# EAGLE design schema_v3_0 (EAGLE 6.4)
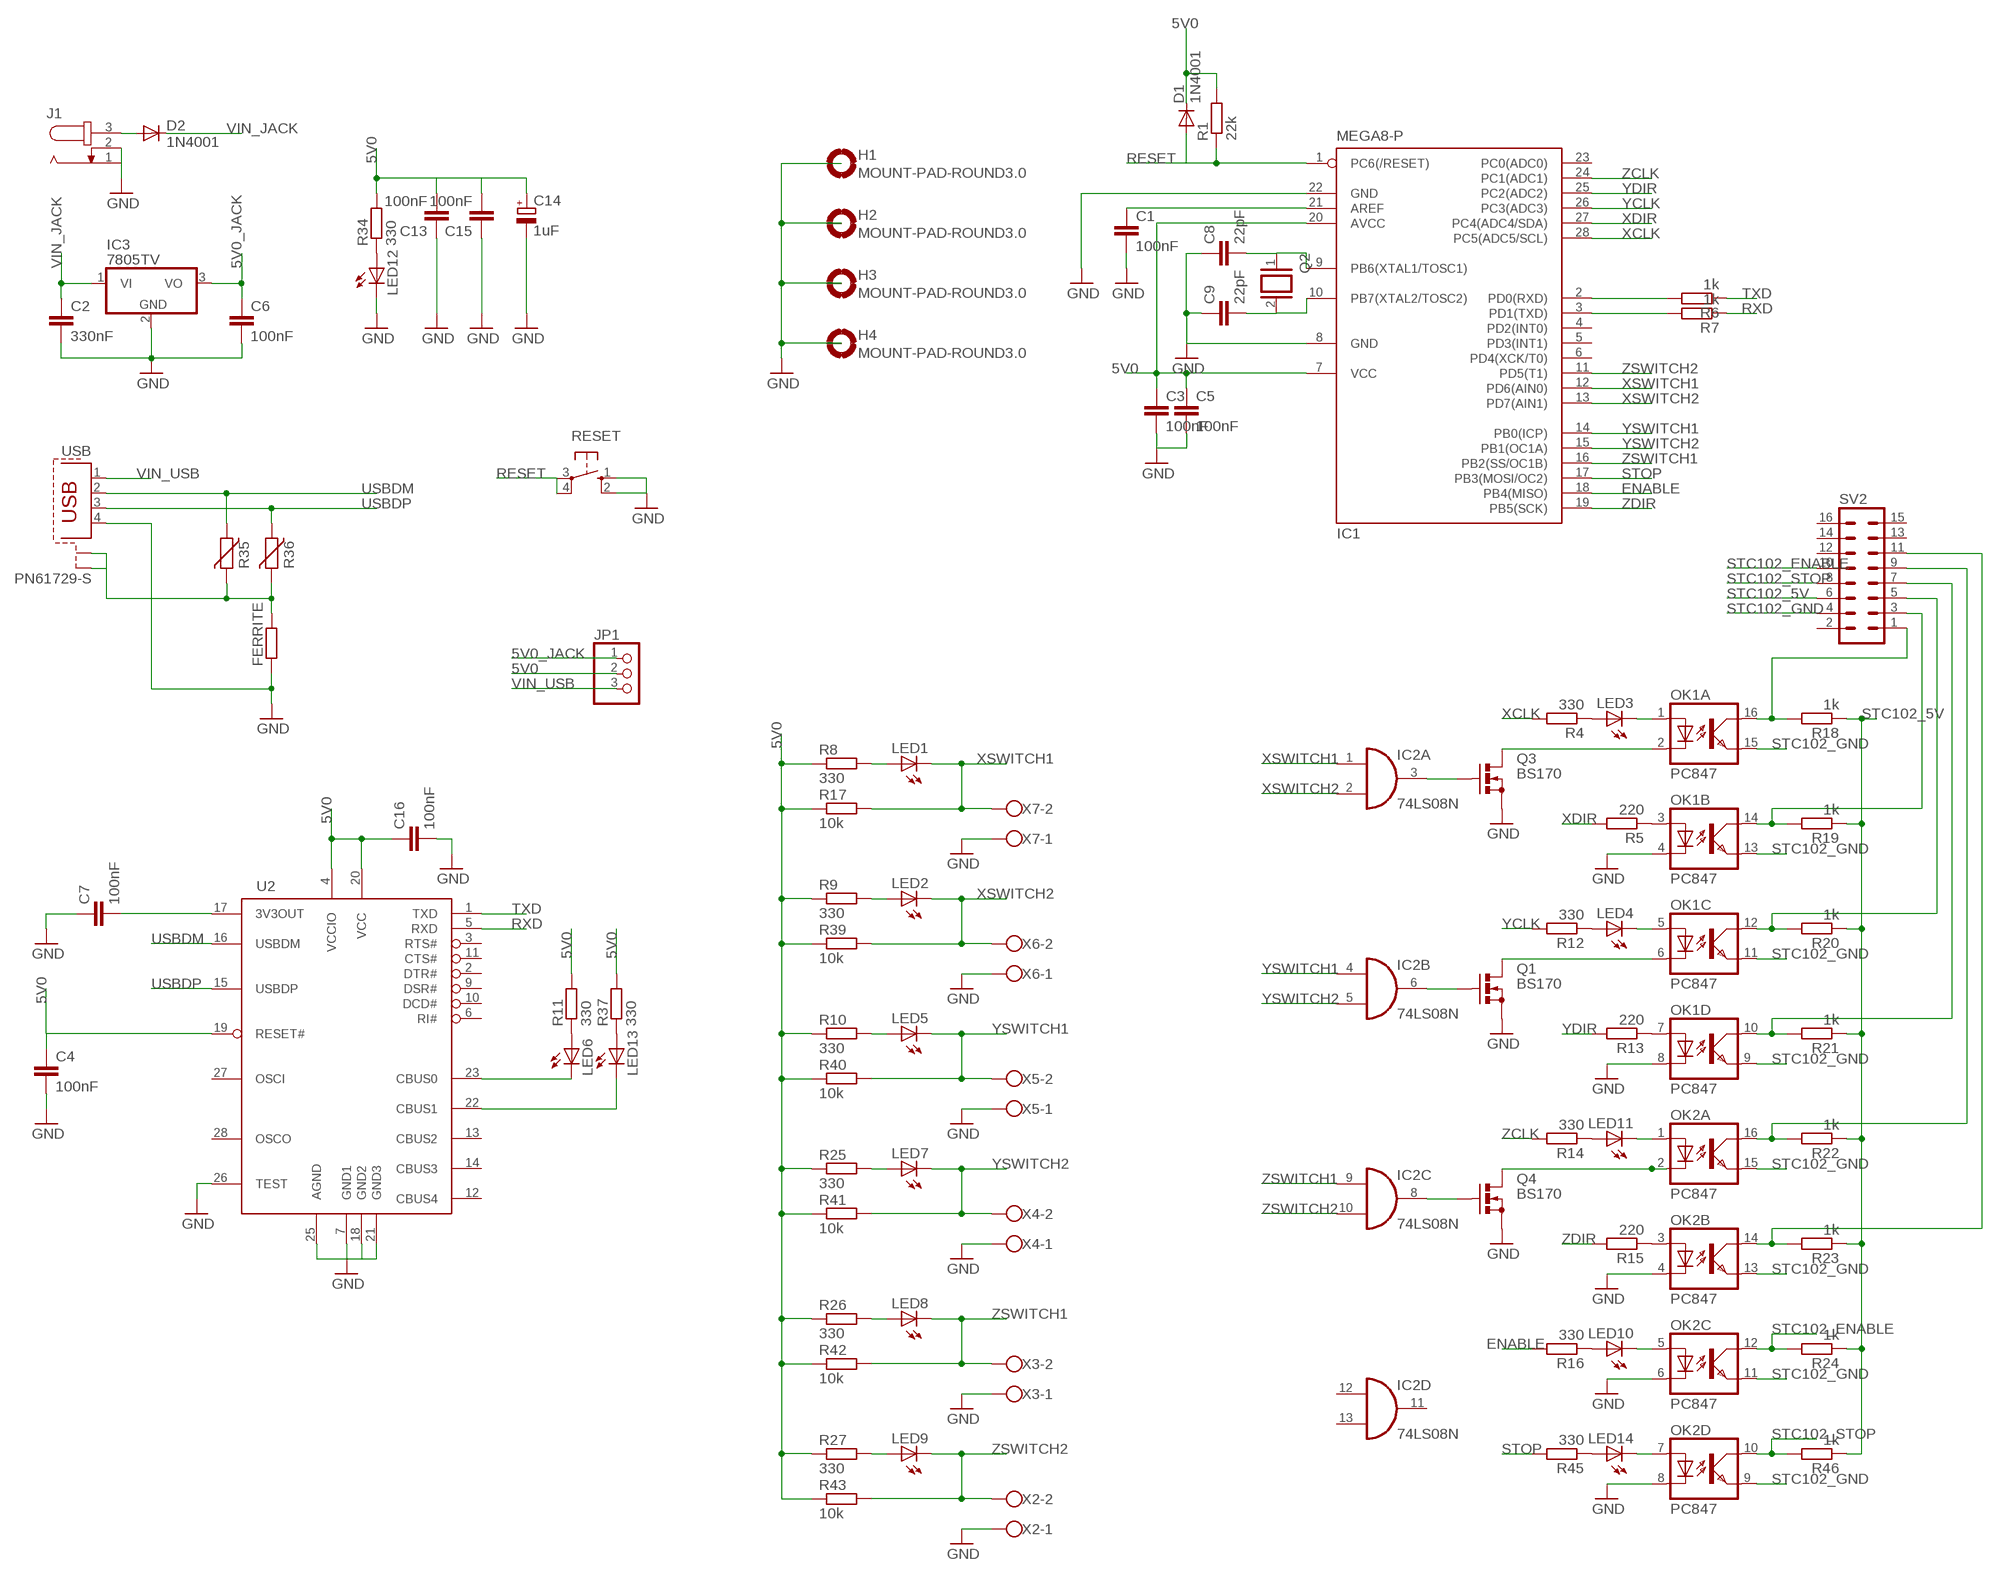
[diagram p0: schematic, sheet 1]

## Parts
C1  100nF  C-EUC0805  [C0805]
C2  330nF  C-EU025-025X050  [C025-025X050]
C3  100nF  C-EU025-025X050  [C025-025X050]
C4  100nF  C-EUC0603K  [C0603K]
C5  100nF  C-EU025-025X050  [C025-025X050]
C6  100nF  C-EU025-025X050  [C025-025X050]
C7  100nF  C-EUC0603K  [C0603K]
C8  22pF  C-EU025-025X050  [C025-025X050]
C9  22pF  C-EU025-025X050  [C025-025X050]
C13  100nF  C-EU025-025X050  [C025-025X050]
C14  1uF  CPOL-EUE2.5-5  [E2,5-5]
C15  100nF  C-EU025-025X050  [C025-025X050]
C16  100nF  C-EUC0603K  [C0603K]
D1  1N4001  1N4004  [DO41-10]
D2  1N4001  1N4004  [DO41-10]
FERRITE  R-EU_M0805  [M0805]
H1  MOUNT-PAD-ROUND3.0  [3,0-PAD]
H2  MOUNT-PAD-ROUND3.0  [3,0-PAD]
H3  MOUNT-PAD-ROUND3.0  [3,0-PAD]
H4  MOUNT-PAD-ROUND3.0  [3,0-PAD]
IC1  MEGA8-P  [DIL28-3]
IC2  74LS08N  [DIL14]
IC3  7805TV  [TO220V]
J1  JACK-PLUG0  [SPC4077]
JP1  PINHD-1X3  [1X03]
LED1  LED3MM  [LED3MM]
LED2  LED3MM  [LED3MM]
LED3  LED3MM  [LED3MM]
LED4  LED3MM  [LED3MM]
LED5  LED3MM  [LED3MM]
LED6  LED3MM  [LED3MM]
LED7  LED3MM  [LED3MM]
LED8  LED3MM  [LED3MM]
LED9  LED3MM  [LED3MM]
LED10  LED3MM  [LED3MM]
LED11  LED3MM  [LED3MM]
LED12  LED3MM  [LED3MM]
LED13  LED3MM  [LED3MM]
LED14  LED3MM  [LED3MM]
OK1  PC847  [DIL16]
OK2  PC847  [DIL16]
Q1  BS170  [SOT54E]
Q2  XTAL/S  [QS]
Q3  BS170  [SOT54E]
Q4  BS170  [SOT54E]
R1  22k  R-EU_0207/10  [0207/10]
R4  330  R-EU_0207/10  [0207/10]
R5  220  R-EU_0207/10  [0207/10]
R6  1k  R-EU_0207/10  [0207/10]
R7  1k  R-EU_0207/10  [0207/10]
R8  330  R-EU_0207/10  [0207/10]
R9  330  R-EU_0207/10  [0207/10]
R10  330  R-EU_0207/10  [0207/10]
R11  330  R-EU_0207/10  [0207/10]
R12  330  R-EU_0207/10  [0207/10]
R13  220  R-EU_0207/10  [0207/10]
R14  330  R-EU_0207/10  [0207/10]
R15  220  R-EU_0207/10  [0207/10]
R16  330  R-EU_0207/10  [0207/10]
R17  10k  R-EU_0207/10  [0207/10]
R18  1k  R-EU_0207/10  [0207/10]
R19  1k  R-EU_0207/10  [0207/10]
R20  1k  R-EU_0207/10  [0207/10]
R21  1k  R-EU_0207/10  [0207/10]
R22  1k  R-EU_0207/10  [0207/10]
R23  1k  R-EU_0207/10  [0207/10]
R24  1k  R-EU_0207/10  [0207/10]
R25  330  R-EU_0207/10  [0207/10]
R26  330  R-EU_0207/10  [0207/10]
R27  330  R-EU_0207/10  [0207/10]
R34  330  R-EU_0207/10  [0207/10]
R35  VARISTORCN0603  [CT/CN0603]
R36  VARISTORCN0603  [CT/CN0603]
R37  330  R-EU_0207/10  [0207/10]
R39  10k  R-EU_0207/10  [0207/10]
R40  10k  R-EU_0207/10  [0207/10]
R41  10k  R-EU_0207/10  [0207/10]
R42  10k  R-EU_0207/10  [0207/10]
R43  10k  R-EU_0207/10  [0207/10]
R45  330  R-EU_0207/10  [0207/10]
R46  1k  R-EU_0207/10  [0207/10]
RESET  10-XX  [B3F-10XX]
SV2  MA08-2  [MA08-2]
U2  FT232RL  [SSOP28DB]
USB  PN61729-S  [PN61729-S]
X2  W237-102  [W237-102]
X3  W237-102  [W237-102]
X4  W237-102  [W237-102]
X5  W237-102  [W237-102]
X6  W237-102  [W237-102]
X7  W237-102  [W237-102]

## Nets
5V0: C3.1 C4.1 C5.1 C13.2 C14.+ C15.2 C16.1 D1.C IC1.7(VCC) IC1.20(AVCC) JP1.2 R1.2 R8.1 R9.1 R10.1 R11.2 R17.1 R25.1 R26.1 R27.1 R34.2 R37.2 R39.1 R40.1 R41.1 R42.1 R43.1 U2.4(VCCIO) U2.19(RESET#) U2.20(VCC)
5V0_JACK: C6.1 IC3.3(VO) JP1.1
ENABLE: IC1.18(PB4(MISO)) R16.2
GND: C1.2 C2.2 C3.2 C4.2 C5.2 C6.2 C7.1 C8.1 C9.1 C13.1 C14.- C15.1 C16.2 FERRITE.1 IC1.8(GND) IC1.22(GND) IC3.2(GND) J1.1 J1.2 LED12.K(C) OK1.4(B:C) OK1.8(D:C) OK2.4(B:C) OK2.6(C:C) OK2.8(D:C) Q1.S Q3.S Q4.S RESET.1(S) RESET.2(S1) U2.7(GND1) U2.18(GND2) U2.21(GND3) U2.25(AGND) U2.26(TEST) USB.4 X2.1 X3.1 X4.1 X5.1 X6.1 X7.1
N$1: LED3.A R4.1
N$2: LED1.A R8.2
N$3: C1.1 IC1.21(AREF)
N$4: LED10.A R16.1
N$5: OK1.2(A:C) Q3.D
N$6: LED4.A R12.1
N$7: LED11.A R14.1
N$8: D2.A J1.3
N$9: OK1.16(A:COL) R18.2 SV2.1
N$10: LED14.A R45.1
N$11: OK1.14(B:COL) R19.2 SV2.3
N$12: OK1.12(C:COL) R20.2 SV2.5
N$13: OK1.10(D:COL) R21.2 SV2.7
N$14: OK2.16(A:COL) R22.2 SV2.9
N$15: OK2.14(B:COL) R23.2 SV2.11
N$16: LED2.A R9.2
N$17: LED6.K(C) U2.23(CBUS0)
N$18: LED13.K(C) U2.22(CBUS1)
N$19: LED6.A R11.1
N$20: LED14.K(C) OK2.7(D:A)
N$21: IC2.3(A:O) Q3.G
N$22: LED10.K(C) OK2.5(C:A)
N$23: LED5.A R10.2
N$24: LED7.A R25.2
N$25: IC1.2(PD0(RXD)) R6.2
N$26: IC1.3(PD1(TXD)) R7.2
N$27: LED8.A R26.2
N$28: LED9.A R27.2
N$29: C8.2 IC1.9(PB6(XTAL1/TOSC1)) Q2.1
N$30: OK1.3(B:A) R5.1
N$31: LED4.K(C) OK1.5(C:A)
N$32: OK1.7(D:A) R13.1
N$33: LED3.K(C) OK1.1(A:A)
N$34: OK2.3(B:A) R15.1
N$35: C9.2 IC1.10(PB7(XTAL2/TOSC2)) Q2.2
N$36: OK1.6(C:C) Q1.D
N$37: OK2.2(A:C) Q4.D
N$38: IC2.8(C:O) Q4.G
N$39: IC2.6(B:O) Q1.G
N$40: LED11.K(C) OK2.1(A:A)
N$51: LED12.A R34.1
N$53: FERRITE.2 R35.2 R36.2 USB.S1 USB.S2
N$55: LED13.A R37.1
N$96: C7.2 U2.17(3V3OUT)
RESET: D1.A IC1.1(PC6(/RESET)) R1.1 RESET.3(P) RESET.4(P1)
RXD: R7.1 U2.5(RXD)
STC102_5V: R18.1 R19.1 R20.1 R21.1 R22.1 R23.1 R24.1 R46.1 SV2.6
STC102_ENABLE: OK2.12(C:COL) R24.2 SV2.10
STC102_GND: OK1.9(D:EMIT) OK1.11(C:EMIT) OK1.13(B:EMIT) OK1.15(A:EMIT) OK2.9(D:EMIT) OK2.11(C:EMIT) OK2.13(B:EMIT) OK2.15(A:EMIT) SV2.4
STC102_STOP: OK2.10(D:COL) R46.2 SV2.8
STOP: IC1.17(PB3(MOSI/OC2)) R45.2
TXD: R6.1 U2.1(TXD)
USBDM: R35.1 U2.16(USBDM) USB.2
USBDP: R36.1 U2.15(USBDP) USB.3
VIN_JACK: C2.1 D2.C IC3.1(VI)
VIN_USB: JP1.3 USB.1
XCLK: IC1.28(PC5(ADC5/SCL)) R4.2
XDIR: IC1.27(PC4(ADC4/SDA)) R5.2
XSWITCH1: IC1.12(PD6(AIN0)) IC2.1(A:I0) LED1.K(C) R17.2 X7.2
XSWITCH2: IC1.13(PD7(AIN1)) IC2.2(A:I1) LED2.K(C) R39.2 X6.2
YCLK: IC1.26(PC3(ADC3)) R12.2
YDIR: IC1.25(PC2(ADC2)) R13.2
YSWITCH1: IC1.14(PB0(ICP)) IC2.4(B:I0) LED5.K(C) R40.2 X5.2
YSWITCH2: IC1.15(PB1(OC1A)) IC2.5(B:I1) LED7.K(C) R41.2 X4.2
ZCLK: IC1.24(PC1(ADC1)) R14.2
ZDIR: IC1.19(PB5(SCK)) R15.2
ZSWITCH1: IC1.16(PB2(SS/OC1B)) IC2.9(C:I0) LED8.K(C) R42.2 X3.2
ZSWITCH2: IC1.11(PD5(T1)) IC2.10(C:I1) LED9.K(C) R43.2 X2.2
Unconnected: H1.B3,0(MOUNT) H2.B3,0(MOUNT) H3.B3,0(MOUNT) H4.B3,0(MOUNT) IC1.4(PD2(INT0)) IC1.5(PD3(INT1)) IC1.6(PD4(XCK/T0)) IC1.23(PC0(ADC0)) IC2.11(D:O) IC2.12(D:I0) IC2.13(D:I1) SV2.2 SV2.12 SV2.13 SV2.14 SV2.15 SV2.16 U2.2(DTR#) U2.3(RTS#) U2.6(RI#) U2.9(DSR#) U2.10(DCD#) U2.11(CTS#) U2.12(CBUS4) U2.13(CBUS2) U2.14(CBUS3) U2.27(OSCI) U2.28(OSCO)

## Power pins joined to a net without a drawn wire
GND: IC2.7(P:GND)
VCC: IC2.14(P:VCC)

## Library data of the parts
C1-C9 C13 C15 C16 = rcl:C-EU: CAPACITOR, European symbol
C14 = rcl:CPOL-EU: POLARIZED CAPACITOR, European symbol
D1 D2 = diode:1N4004: DIODE general purpose rectifier, 1 A
FERRITE = resistor:R-EU_: RESISTOR, European symbol
H1-H4 = holes:MOUNT-PAD-ROUND: MOUNTING PAD, round
IC1 = atmel:MEGA8-P: MICROCONTROLLER 8 Kbytes FLASH, 1 kbytes SRAM, 512 bytes EEPROM, USART, 4-channel 10 bit ADC, 2-channel 8 bit ADC Pin compatible with Atmega48, ATMega88, ATMega168 Source: avr.lbr; OC_FARNELL: unknown; OC_NEWARK: unknown
IC2 = 74xx-eu:74*08: Quad 2-input AND gate
IC3 = linear:78*: Positive VOLTAGE REGULATOR Source: http://cache.national.com/ds/LM/LM78L05.pdf http://www.fairchildsemi.com/ds/LM/LM7805.pdf
J1 = con-jack:JACK-PLUG: DC POWER JACK Power Jack, DC, Right Angle, Through Hole, Rated 5A at 16VDC, PC Terminals Distributor: Farnell (www.Farnell.de) Drawing: 84N1161.pdf / 84N1162.pdf Manufacturer: SPC Technology (www.spctechnology.com) Type: SPC4077 / SPC 4078; OC_FARNELL: unknown; OC_NEWARK: unknown
JP1 = pinhead:PINHD-1X3: PIN HEADER
LED1-LED14 = led:LED: LED OSRAM: - CHIPLED LG R971, LG N971, LY N971, LG Q971, LY Q971, LO R971, LY R971 LH N974, LH R974 LS Q976, LO Q976, LY Q976 LO Q996 - Hyper CHIPLED LW Q18S LB Q993, LB Q99A, LB R99A - SideLED LS A670, LO A670, LY A670, LG A670, LP A670 LB A673, LV A673, LT A673, LW A673 LH A674 LY A675 LS A676, LA A676, LO A676, LY A676, LW A676 LS A679, LY A679, LG A679 - Hyper Micro SIDELED® LS Y876, LA Y876, LO Y876, LY Y876 LT Y87S - SmartLED LW L88C, LW L88S LB L89C, LB L89S, LG L890 LS L89K, LO L89K, LY L89K LS L896, LA L896, LO L896, LY L896 - TOPLED LS T670, LO T670, LY T670, LG T670, LP T670 LSG T670, LSP T670, LSY T670, LOP T670, LYG T670 LG T671, LOG T671, LSG T671 LB T673, LV T673, LT T673, LW T673 LH T674 LS T676, LA T676, LO T676, LY T676, LB T676, LH T676, LSB T676, LW T676 LB T67C, LV T67C, LT T67C, LS T67K, LO T67K, LY T67K, LW E67C LS E67B, LA E67B, LO E67B, LY E67B, LB E67C, LV E67C, LT E67C LW T67C LS T679, LY T679, LG T679 LS T770, LO T770, LY T770, LG T770, LP T770 LB T773, LV T773, LT T773, LW T773 LH T774 LS E675, LA E675, LY E675, LS T675 LS T776, LA T776, LO T776, LY T776, LB T776 LHGB T686 LT T68C, LB T68C - Hyper Mini TOPLED® LB M676 - Mini TOPLED Santana® LG M470 LS M47K, LO M47K, LY M47K Source: http://www.osram.convergy.de LUXEON: - LUMILED® LXK2-PW12-R00, LXK2-PW12-S00, LXK2-PW14-U00, LXK2-PW14-V00 LXK2-PM12-R00, LXK2-PM12-S00, LXK2-PM14-U00 LXK2-PE12-Q00, LXK2-PE12-R00, LXK2-PE12-S00, LXK2-PE14-T00, LXK2-PE14-U00 LXK2-PB12-K00, LXK2-PB12-L00, LXK2-PB12-M00, LXK2-PB14-N00, LXK2-PB14-P00, LXK2-PB14-Q00 LXK2-PR12-L00, LXK2-PR12-M00, LXK2-PR14-Q00, LXK2-PR14-R00 LXK2-PD12-Q00, LXK2-PD12-R00, LXK2-PD12-S00 LXK2-PH12-R00, LXK2-PH12-S00 LXK2-PL12-P00, LXK2-PL12-Q00, LXK2-PL12-R00 Source: www.luxeon.com KINGBRIGHT: KA-3528ASYC Source: www.kingbright.com
OK1 OK2 = optocoupler:PC847: SHARP OPTO COUPLER; OC_FARNELL: 9707735; OC_NEWARK: unknown
Q1 Q3 Q4 = transistor-small-signal:BS170: N-CHANNEL MOS FET
Q2 = special:XTAL/S: CRYSTAL
R1 R4-R27 R34 R37 R39-R43 R45 R46 = rcl:R-EU_: RESISTOR, European symbol
R35 R36 = varistor:VARISTOR: VARISTOR
RESET = switch-omron:10-XX: OMRON SWITCH; MPN: B3F-1000; OC_FARNELL: 176432; OC_NEWARK: 36M3542
SV2 = con-lstb:MA08-2: PIN HEADER; OC_FARNELL: unknown; OC_NEWARK: unknown
U2 = ftdichip-5:FT232RL: USB UART 4th Generation USB UART (USB <-> Serial) Controller
USB = con-berg:PN61729-S: BERG USB connector; OC_FARNELL: unknown; OC_NEWARK: unknown
X2-X7 = con-wago-500:W237-102: WAGO SCREW CLAMP; MPN: 237-102; OC_FARNELL: unknown; OC_NEWARK: 70K9898

## Net classes
0 default: width 0.203 mm

## Board
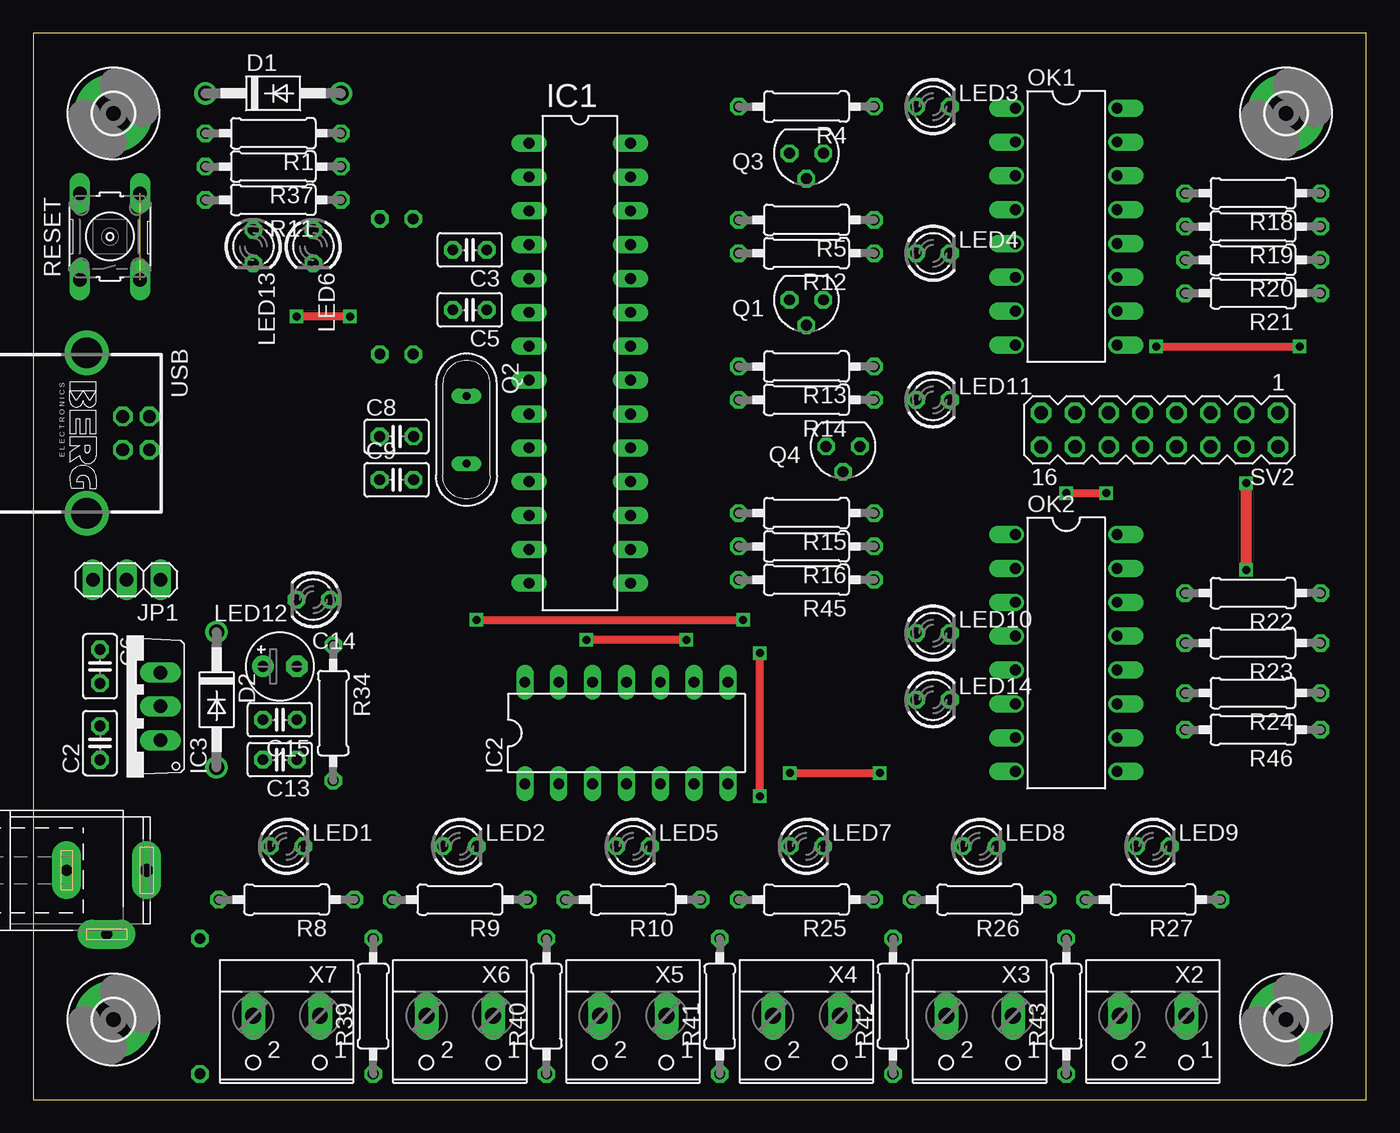
[diagram p1: board, top side]
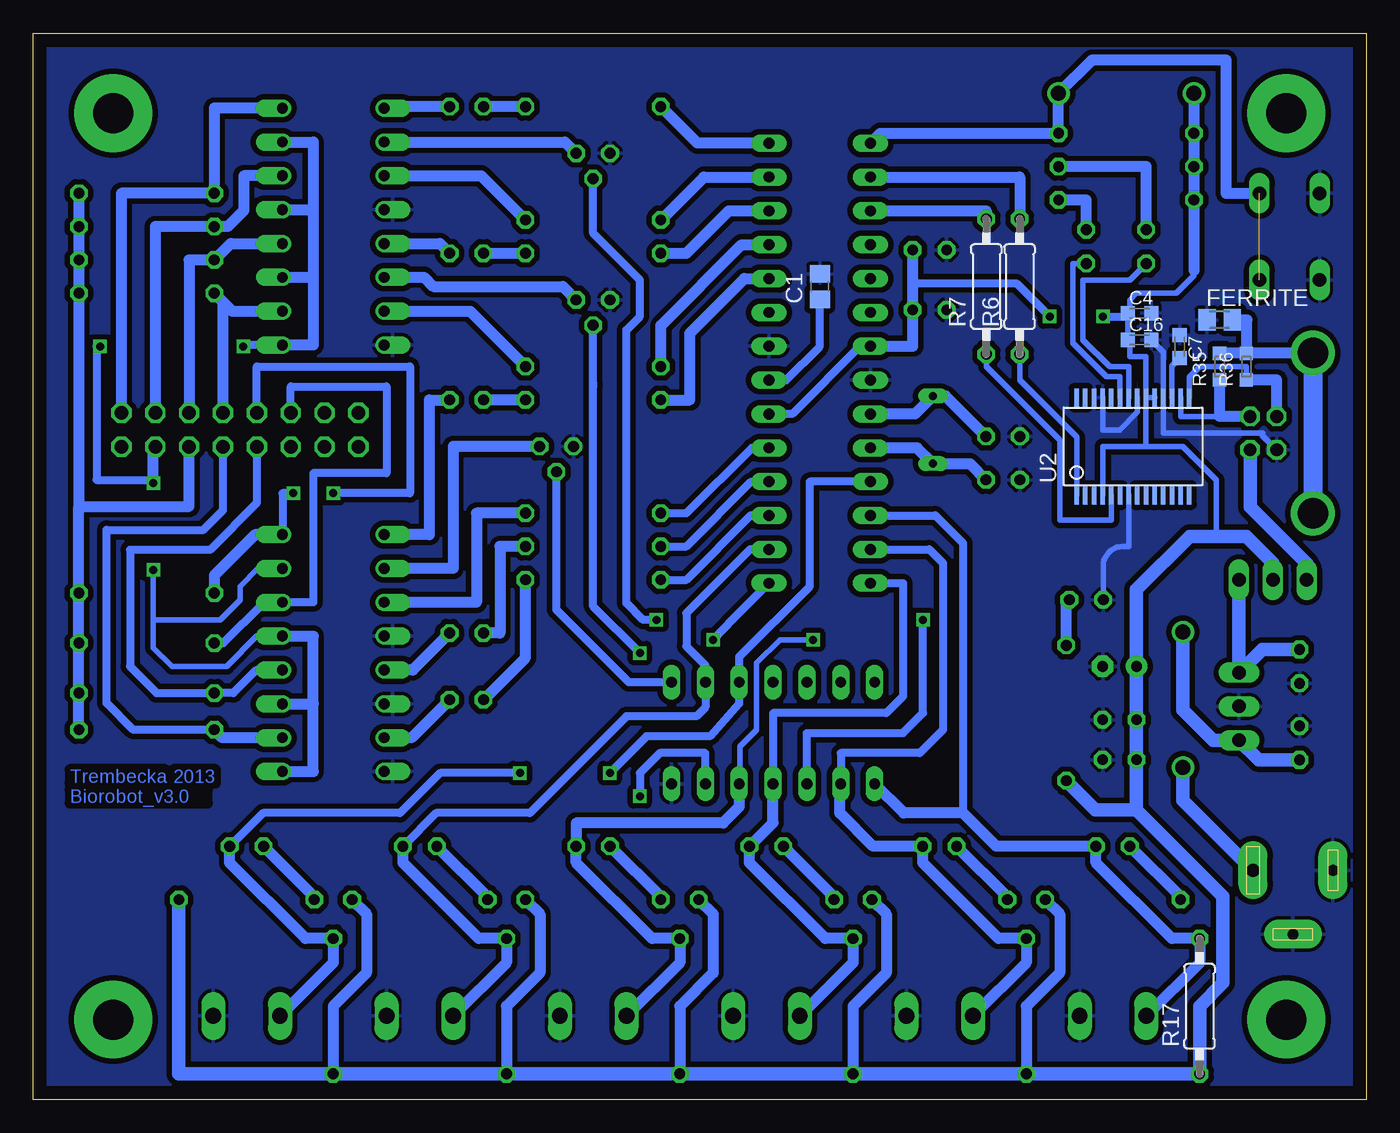
[diagram p2: board, bottom side, seen from below]

Size 100 x 80 mm. Coordinates in mm from the lower left corner, seen from the top.
Outline: 0,0 100,0 100,80 0,80 0,0
Copper layers (1*16): Top 0.035mm / dielectric 1.5mm / Bottom 0.035mm
Design rules "default": minimum track width 10mil, minimum drill 24mil, track to track 8mil, track to pad 8mil, pad to pad 8mil, via to via 8mil, smd to smd 8mil, copper to edge 40mil, drill to drill 8mil, minimum pad ring 10mil, minimum via ring 8mil, stop-mask expansion 4mil, vias tented up to drill 0mil, thermal gap 10mil

### Footprints (pad centres in the part's own frame; a part is rotated, then mirrored left to right if it is on the bottom)
C0805 = smd 1.3 x 1.5: 1 -0.95,0; 2 0.95,0
C025-025X050 = drill 0.813 octagon: 1 -1.27,0; 2 1.27,0
C0603K = smd 1.05 x 1.08: 1 -0.875,0; 2 0.875,0
E2,5-5 = drill 0.813 pad 1.6: + -1.27,0 | drill 0.813 pad 1.6 octagon: - 1.27,0
DO41-10 = drill 1.118: A 5.08,0; C -5.08,0
M0805 = smd 1.3 x 1.6: 1 -0.95,0; 2 0.95,0
3,0-PAD = drill 3 pad 5.842: B3,0 0,0
DIL28-3 = drill 0.813 long: 1 -16.51,-3.81; 2 -13.97,-3.81; 3 -11.43,-3.81; 4 -8.89,-3.81; 5 -6.35,-3.81; 6 -3.81,-3.81; 7 -1.27,-3.81; 8 1.27,-3.81; 9 3.81,-3.81; 10 6.35,-3.81; 11 8.89,-3.81; 12 11.43,-3.81; 13 13.97,-3.81; 14 16.51,-3.81; 15 16.51,3.81; 16 13.97,3.81; 17 11.43,3.81; 18 8.89,3.81; 19 6.35,3.81; 20 3.81,3.81; 21 1.27,3.81; 22 -1.27,3.81; 23 -3.81,3.81; 24 -6.35,3.81; 25 -8.89,3.81; 26 -11.43,3.81; 27 -13.97,3.81; 28 -16.51,3.81
DIL14 = drill 0.813 long: 1 -7.62,-3.81; 2 -5.08,-3.81; 3 -2.54,-3.81; 4 0,-3.81; 5 2.54,-3.81; 6 5.08,-3.81; 7 7.62,-3.81; 8 7.62,3.81; 9 5.08,3.81; 10 2.54,3.81; 11 0,3.81; 12 -2.54,3.81; 13 -5.08,3.81; 14 -7.62,3.81
TO220V = drill 1.016 long: 1 -2.54,-2.54; 2 0,-2.54; 3 2.54,-2.54
SPC4077 = drill 0.8 pad 2.184 long: 1 -3,0; 2 0,-4.8 | drill 1 pad 2.184 long: 3 3,0
1X03 = drill 1.016 long: 1 -2.54,0; 2 0,0; 3 2.54,0
LED3MM = drill 0.813 octagon: A -1.27,0; K 1.27,0
DIL16 = drill 0.813 offset: 1 -8.89,-3.81; 2 -6.35,-3.81; 3 -3.81,-3.81; 4 -1.27,-3.81; 5 1.27,-3.81; 6 3.81,-3.81; 7 6.35,-3.81; 8 8.89,-3.81; 9 8.89,3.81; 10 6.35,3.81; 11 3.81,3.81; 12 1.27,3.81; 13 -1.27,3.81; 14 -3.81,3.81; 15 -6.35,3.81; 16 -8.89,3.81
SOT54E = drill 0.813 octagon: D -1.27,0; G 0,1.905; S 1.27,0
QS = drill 0.61 long: 1 -2.54,0; 2 2.54,0
0207/10 = drill 0.813 octagon: 1 -5.08,0; 2 5.08,0
CT/CN0603 = smd 1 x 1: 1 -1,0; 2 1,0
B3F-10XX = drill 1.016 long: 1 -3.251,2.261; 2 3.251,2.261; 3 -3.251,-2.261; 4 3.251,-2.261
MA08-2 = drill 1.016 octagon: 1 -8.89,-1.27; 2 -8.89,1.27; 3 -6.35,-1.27; 4 -6.35,1.27; 5 -3.81,-1.27; 6 -3.81,1.27; 7 -1.27,-1.27; 8 -1.27,1.27; 9 1.27,-1.27; 10 1.27,1.27; 11 3.81,-1.27; 12 3.81,1.27; 13 6.35,-1.27; 14 6.35,1.27; 15 8.89,-1.27; 16 8.89,1.27
SSOP28DB = smd 0.348 x 1.397: 1 -4.225,-3.656; 2 -3.575,-3.656; 3 -2.925,-3.656; 4 -2.275,-3.656; 5 -1.625,-3.656; 6 -0.975,-3.656; 7 -0.325,-3.656; 8 0.325,-3.656; 9 0.975,-3.656; 10 1.625,-3.656; 11 2.275,-3.656; 12 2.925,-3.656; 13 3.575,-3.656; 14 4.225,-3.656; 15 4.225,3.656; 16 3.575,3.656; 17 2.925,3.656; 18 2.275,3.656; 19 1.625,3.656; 20 0.975,3.656; 21 0.325,3.656; 22 -0.325,3.656; 23 -0.975,3.656; 24 -1.625,3.656; 25 -2.275,3.656; 26 -2.925,3.656; 27 -3.575,3.656; 28 -4.225,3.656
PN61729-S = drill 0.95 octagon: 1 1.25,4.71; 2 -1.25,4.71; 3 -1.25,2.71; 4 1.25,2.71 | drill 2.3 pad 2.9: S1 -6.02,0; S2 6.02,0
W237-102 = drill 1.194 long: 1 -2.5,-1.27; 2 2.5,-1.27

### Placement (x,y rotation side)
C1  41,61 90 bottom
C2  5,26.75 90 top
C3  32.75,63.75 180 top
C4  17,59 0 bottom
C5  32.75,59.25 180 top
C6  5,32.5 270 top
C7  14,56.5 270 bottom
C8  27.25,49.75 0 top
C9  27.25,46.5 0 top
C13  18.5,25.5 180 top
C14  18.5,32.5 0 top
C15  18.5,28.5 180 top
C16  17,57 0 bottom
D1  18,75.5 0 top
D2  13.75,30 270 top
FERRITE  11,58.5 0 bottom
H1  94,74 0 top
H2  6,74 0 top
H3  6,6 0 top
H4  94,6 0 top
IC1  41,55.25 270 top
IC2  44.5,27.5 0 top
IC3  7,29.5 90 top
J1  5.5,17.2 0 top
JP1  7,39 180 top
LED1  19,19 0 top
LED2  32,19 0 top
LED3  67.5,74.5 0 top
LED4  67.5,63.5 0 top
LED5  45,19 0 top
LED6  21,64 270 top
LED7  58,19 0 top
LED8  71,19 0 top
LED9  84,19 0 top
LED10  67.5,35 0 top
LED11  67.5,52.5 0 top
LED12  21,37.5 180 top
LED13  16.5,64 270 top
LED14  67.5,30 0 top
OK1  77.5,65.5 270 top
OK2  77.5,33.5 270 top
Q1  58,60 180 top
Q2  32.5,50.25 270 top
Q3  58,71 180 top
Q4  60.75,49 180 top
R1  18,72.5 180 top
R4  58,74.5 180 top
R5  58,66 180 top
R6  26,61 90 bottom
R7  28.5,61 90 bottom
R8  19,15 180 top
R9  32,15 180 top
R10  45,15 180 top
R11  18,67.5 180 top
R12  58,63.5 180 top
R13  58,55 180 top
R14  58,52.5 180 top
R15  58,44 180 top
R16  58,41.5 180 top
R17  12.5,7 90 bottom
R18  91.5,68 180 top
R19  91.5,65.5 180 top
R20  91.5,63 180 top
R21  91.5,60.5 180 top
R22  91.5,38 180 top
R23  91.5,34.25 180 top
R24  91.5,30.5 180 top
R25  58,15 180 top
R26  71,15 180 top
R27  84,15 180 top
R34  22.5,29 270 top
R35  11,55 90 bottom
R36  9,55 90 bottom
R37  18,70 180 top
R39  25.5,7 90 top
R40  38.5,7 90 top
R41  51.5,7 90 top
R42  64.5,7 90 top
R43  77.5,7 90 top
R45  58,39 180 top
R46  91.5,27.75 180 top
RESET  5.75,64.75 90 top
SV2  84.5,50.25 180 top
U2  17.5,49 0 bottom
USB  4,50 270 top
X2  84,5 180 top
X3  71,5 180 top
X4  58,5 180 top
X5  45,5 180 top
X6  32,5 180 top
X7  19,5 180 top

### Tracks (layer width: path | path; a pad name or v marks a point on that pad's centre or on a via)
5V0  (via drill 0.6)
  Top 0.61: v23.75,58.75 v19.75,58.75
  Bottom 0.406: U2.19 U2.20 | U2.20 16.52,49 | U2.4 19.77,49 16.52,49 | U2.20 16.52,55.75 17.75,55.75 17.75,57.38 C16.1 C4.1 17.75,59.62 17.75,60 17.25,60.5 14.25,60.5 12.92,61.83 12.92,62.2 | 16.52,49 13.75,49 11.25,46.5 11.25,42.25
  Bottom 0.61: IC1.7 37.98,56.52 43.06,51.44 IC1.20 | 34.02,61.25 26.25,61.25 v23.75,58.75 | v19.75,58.75 18.12,58.75 C4.1
  Bottom 0.813: D1.C R1.2 R37.2 R11.2 12.92,62.2 | R26.1 75,13.92 75,9.5 77.5,7 R43.1 | R25.1 62,13.92 62,9.5 64.5,7 R42.1 | R10.1 49,13.92 49,9.5 51.5,7 R41.1 | R9.1 36,13.92 36,9.5 38.5,7 R40.1 | R8.1 23,13.92 23,9.5 25.5,7 R39.1 | C14.+ 17.25,32.52 | IC1.7 34.02,56.52 C5.1 | C5.1 C3.1 | C5.1 34.02,61.25
  Bottom 1.016: R27.1 89.08,1.92 R43.1 R42.1 R41.1 R40.1 R39.1 R17.1 12.5,7 10.75,8.75 10.75,15.25 17.23,21.73 | 17.23,21.73 C13.2 C15.2 C14.+ 17.23,38.27 13.25,42.25 11.25,42.25 9,42.25 7,40.25 JP1.2 7,40 | R34.2 20.31,21.73 17.23,21.73
5V0_JACK
  Bottom 1.016: C6.1 7.81,33.77 IC3.3 JP1.1
ENABLE
  Bottom 0.61: R16.2 51,41.5 46.14,46.36 IC1.18
GND
  Bottom 0.406: USB.4 7.75,49.79 7.75,50 15.22,50 U2.18 15.22,56.1 C16.2 | U2.25 19.75,52.63 19.75,50.25 18.5,50.25 17.18,51.58 U2.21 | U2.7 17.82,41.5 18.25,41.5 arc-90 19.73,40.02 LED12.K
  pour Bottom (isolate 0.406): 0,80 100,80 100,0 0,0
N$1
  Bottom 0.813: R4.1 LED3.A
N$2
  Bottom 0.813: LED1.A 13.92,15.19 R8.2
N$3
  Bottom 0.61: IC1.21 43.52,53.98 41,56.5 C1.1
N$4
  Bottom 0.813: R16.1 65,41.5 65,35 LED10.A
N$5
  Bottom 0.813: OK1.2 60.12,71.85 Q3.D
N$6
  Bottom 0.813: LED4.A R12.1
N$7
  Bottom 0.813: R14.1 LED11.A
N$8
  Bottom 1.016: J1.3 13.75,22.45 D2.A
N$9
  Bottom 0.813: OK1.16 86.42,74.39 R18.2 93.39,68 SV2.1
N$10
  Bottom 0.813: LED14.A 63.08,33.15 R45.1
N$11
  Bottom 0.813: OK1.14 84.2,69.31 84.2,66.7 85.4,65.5 R19.2 90.85,65.5 SV2.3
N$12
  Bottom 0.813: OK1.12 85.19,64.23 R20.2 88.31,63 SV2.5
N$13
  Bottom 0.813: OK1.10 85.07,59.15 R21.2 85.77,59.85 SV2.7
N$14  (via drill 0.6)
  Top 0.61: v77.5,45.5 v80.5,45.5
  Bottom 0.61: SV2.9 83.23,55 71.75,55 71.75,45.5 v77.5,45.5 | v80.5,45.5 81.31,45.5 OK2.16
  Bottom 0.813: OK2.16 83.36,42.39 86.42,39.33 R22.2
N$15
  Bottom 0.61: SV2.11 80.69,53.5 73.5,53.5 73.5,47 79,47 79,37.31 OK2.14 82.69,37.31 85.75,34.25 R23.2
N$16
  Bottom 0.813: LED2.A 26.92,15.19 R9.2
N$17
  Bottom 0.406: LED6.K 22,62.73 22,56.75 19.5,54.25 18.48,54.25 U2.23
N$18
  Bottom 0.406: LED13.K 17.73,61.5 21.25,61.5 21.25,57 19.25,55 17.82,55 U2.22
N$19
  Bottom 0.813: LED6.A 21,67.5 R11.1
N$20
  Bottom 0.813: LED14.K 71.62,27.15 OK2.7
N$21  (via drill 0.6)
  Top 0.61: v33.25,36 v53.25,36
  Bottom 0.61: IC2.3 41.96,27.5 34.75,27.5 33.25,29 v33.25,36 | v53.25,36 54.25,36 55.5,37.25 55.5,57.75 54.5,58.75 54.5,61.5 58,65 Q3.G
N$22
  Bottom 0.813: LED10.K 71.54,32.23 OK2.5
N$23
  Bottom 0.813: LED5.A 39.92,15.19 R10.2
N$24
  Bottom 0.813: LED7.A 52.92,15.19 R25.2
N$25
  Bottom 0.813: IC1.2 26,69.22 R6.2
N$26
  Bottom 0.813: IC1.3 28.5,66.68 R7.2
N$27
  Bottom 0.813: LED8.A 65.92,15.19 R26.2
N$28
  Bottom 0.813: LED9.A 78.92,15.19 R27.2
N$29
  Bottom 0.813: C8.2 31.56,52.79 Q2.1 33.85,51.44 IC1.9
N$30
  Bottom 0.813: OK1.3 66.39,69.31 R5.1
N$31
  Bottom 0.813: OK1.5 69.5,64.23 LED4.K
N$32
  Bottom 0.813: OK1.7 67.23,59.15 R13.1
N$33
  Bottom 0.813: LED3.K 73.58,74.5 OK1.1
N$34
  Bottom 0.813: R15.1 66.75,44 66.75,37.31 OK2.3
N$35
  Bottom 0.813: C9.2 29.73,47.71 Q2.2 33.69,48.9 IC1.10
N$36
  Bottom 0.813: OK1.6 70.69,61.69 70,61 60.27,61 Q1.D
N$37
  Bottom 0.813: Q4.D 68.5,49 68.5,39.85 OK2.2
N$38
  Bottom 0.61: IC2.8 55.31,31.31 60.75,36.75 Q4.G
N$39  (via drill 0.6)
  Top 0.61: v54.5,22.75 v54.5,33.5
  Bottom 0.61: IC2.6 49.58,26 53,26 54.5,24.5 v54.5,22.75 | Q1.G 58,53.75 58,53.5 58,37 v54.5,33.5
N$40
  Bottom 0.813: OK2.1 70.27,42.39 70.27,52.5 LED11.K
N$51
  Bottom 0.813: R34.1 22.5,37.5 LED12.A
N$53
  Bottom 0.813: R36.2 8.95,56 8.95,58.5 FERRITE.2 | R36.2 R35.2 | USB.S1 4,56 R36.2
  Bottom 1.422: USB.S1 USB.S2
N$55
  Bottom 0.813: LED13.A 16.5,70 R37.1
N$96
  Bottom 0.406: C7.2 14.57,55.05 U2.17
RESET  (1 unrouted)
  Bottom 0.813: RESET.4 10.5,68 10.5,78 20.58,78 D1.A R1.1 36.45,72.5 IC1.1
RXD
  Bottom 0.406: R7.1 28.5,55 23,49.5 23,43.5 19.12,43.5 U2.5
STC102_5V
  Bottom 0.813: 96.58,44.5 R22.1 R23.1 R24.1 R46.1 | 96.58,44.5 88.31,44.5 SV2.6 | R18.1 R19.1 R20.1 R21.1 96.58,44.5
STC102_ENABLE
  Bottom 0.61: SV2.10 83.23,44.77 86.75,41.25 92.75,41.25 92.75,32.5 90.75,30.5 R24.2 85,30.5 83.27,32.23 OK2.12
STC102_GND  (via drill 0.6)
  Top 0.61: v84.25,56.5 v95,56.5
  Top 0.813: v91,39.75 v91,46.25
  Bottom 0.406: 79,34.77 79,34.75 | 91,36 91,33.9 89.6,32.5 85.5,32.5 83.23,34.77 OK2.13 | 91,36 v91,39.75 | OK2.15 83.15,39.85 84.5,38.5 84.5,37.5 86,36 91,36
  Bottom 0.61: OK1.9 84.25,56.61 v84.25,56.5 | v95,56.5 95.25,56.5 95.25,46.5 91,46.5 v91,46.25
  Bottom 0.813: OK2.9 79,24.61 79,29.69 | OK2.11 79,29.69 | 79,29.69 79,34.77 OK2.13 | OK1.15 79,71.85 79,66.77 | OK1.13 79,66.77 | 79,66.77 79,61.69 | OK1.11 79,61.69 | 79,61.69 79,56.61 OK1.9 | v91,46.25 91,48.83 SV2.4
STC102_STOP
  Bottom 0.61: SV2.8 85.77,44.23 87.25,42.75 94.5,42.75 94.5,29.75 92.5,27.75 R46.2
  Bottom 0.813: OK2.10 85.82,27.15 R46.2
STOP
  Bottom 0.61: R45.2 51,39 46.18,43.82 IC1.17
TXD
  Bottom 0.406: R6.1 26,54 21.73,49.73 U2.1
USBDM
  Bottom 0.406: U2.16 13.93,51.25 11,51.25
  Bottom 0.813: USB.2 11,51.25 R35.1
USBDP
  Bottom 0.406: R36.1 9,55 12.5,55 13.28,54.23 U2.15
  Bottom 0.813: USB.3 6.71,54 R36.1
VIN_JACK
  Bottom 1.016: C2.1 8.06,25.48 IC3.1 11.46,26.96 13.75,29.25 D2.C
VIN_USB
  Bottom 1.016: JP1.3 4.46,40.21 8.71,44.46 USB.1
XCLK
  Bottom 0.813: IC1.28 50.18,71.76 R4.2
XDIR
  Bottom 0.813: R5.2 49.7,69.22 IC1.27
XSWITCH1
  Bottom 0.61: IC1.12 32.32,43.82 30.25,41.75 30.25,21.5
  Bottom 0.813: X7.2 12.5,10.27 R17.2 14.58,12.08 20.27,17.77 LED1.K 27.75,19 30.25,21.5 34.69,21.5 IC2.1
XSWITCH2
  Bottom 0.61: IC1.13 32.78,41.28 31.75,40.25 31.75,27.75 33.5,26 39.42,26 IC2.2
  Bottom 0.813: X6.2 25.5,10.27 R39.2 27.58,12.08 33.27,17.77 LED2.K 37,19 39.5,21.5 39.5,23.61 IC2.2
YCLK
  Bottom 0.813: R12.2 51,63.5 47.82,66.68 IC1.26
YDIR
  Bottom 0.813: R13.2 52.92,58.08 46.86,64.14 IC1.25
YSWITCH1
  Bottom 0.61: IC1.14 34.75,38.74 34.75,30.25 36,29 44.5,29 IC2.4
  Bottom 0.813: X5.2 38.5,10.27 R40.2 40.58,12.08 46.27,17.77 LED5.K 44.5,20.77 IC2.4
YSWITCH2  (via drill 0.6)
  Top 0.61: v49,34.5 v41.5,34.5
  Bottom 0.406: v41.5,34.5 44,34.5 45.75,32.75 45.75,27.75 47,26.5 47,23.73 IC2.5
  Bottom 0.61: IC1.15 47.5,36.05 v49,34.5
  Bottom 0.813: X4.2 51.5,10.27 R41.2 53.58,12.08 59.27,17.77 LED7.K 59.27,20.75 48.25,20.75 47.04,21.96 IC2.5
ZCLK
  Bottom 0.813: R14.2 50.75,52.5 50.75,57.5 46.65,61.6 IC1.24
ZDIR
  Bottom 0.61: R15.2 51,44 46.1,48.9 IC1.19
ZSWITCH1
  Bottom 0.61: IC1.16 46.22,41.28 51,36.5 51,34 49.58,32.58 IC2.9 49.58,29.42 50.25,28.75 55.5,28.75 62.75,21.5 69.77,21.5 LED8.K
  Bottom 0.813: X3.2 64.5,10.27 R42.2 66.58,12.08 72.27,17.77 LED8.K
ZSWITCH2  (via drill 0.6)
  Top 0.61: v56.75,24.5 v63.5,24.5
  Bottom 0.61: v56.75,24.5 54,27.25 49.25,27.25 47.04,29.71 IC2.10 47.04,33.21 41.75,38.5 41.75,46.36 IC1.11 | v63.5,24.5 69.5,24.5 72.5,21.5 82.77,21.5 LED9.K
  Bottom 0.813: X2.2 77.5,10.27 R43.2 79.58,12.08 85.27,17.77 LED9.K

### Text on the board
Bottom: 2013 | Trembecka | Biorobot_v3.0